# EAGLE design raspdancer21_1.0 (EAGLE 6.4)
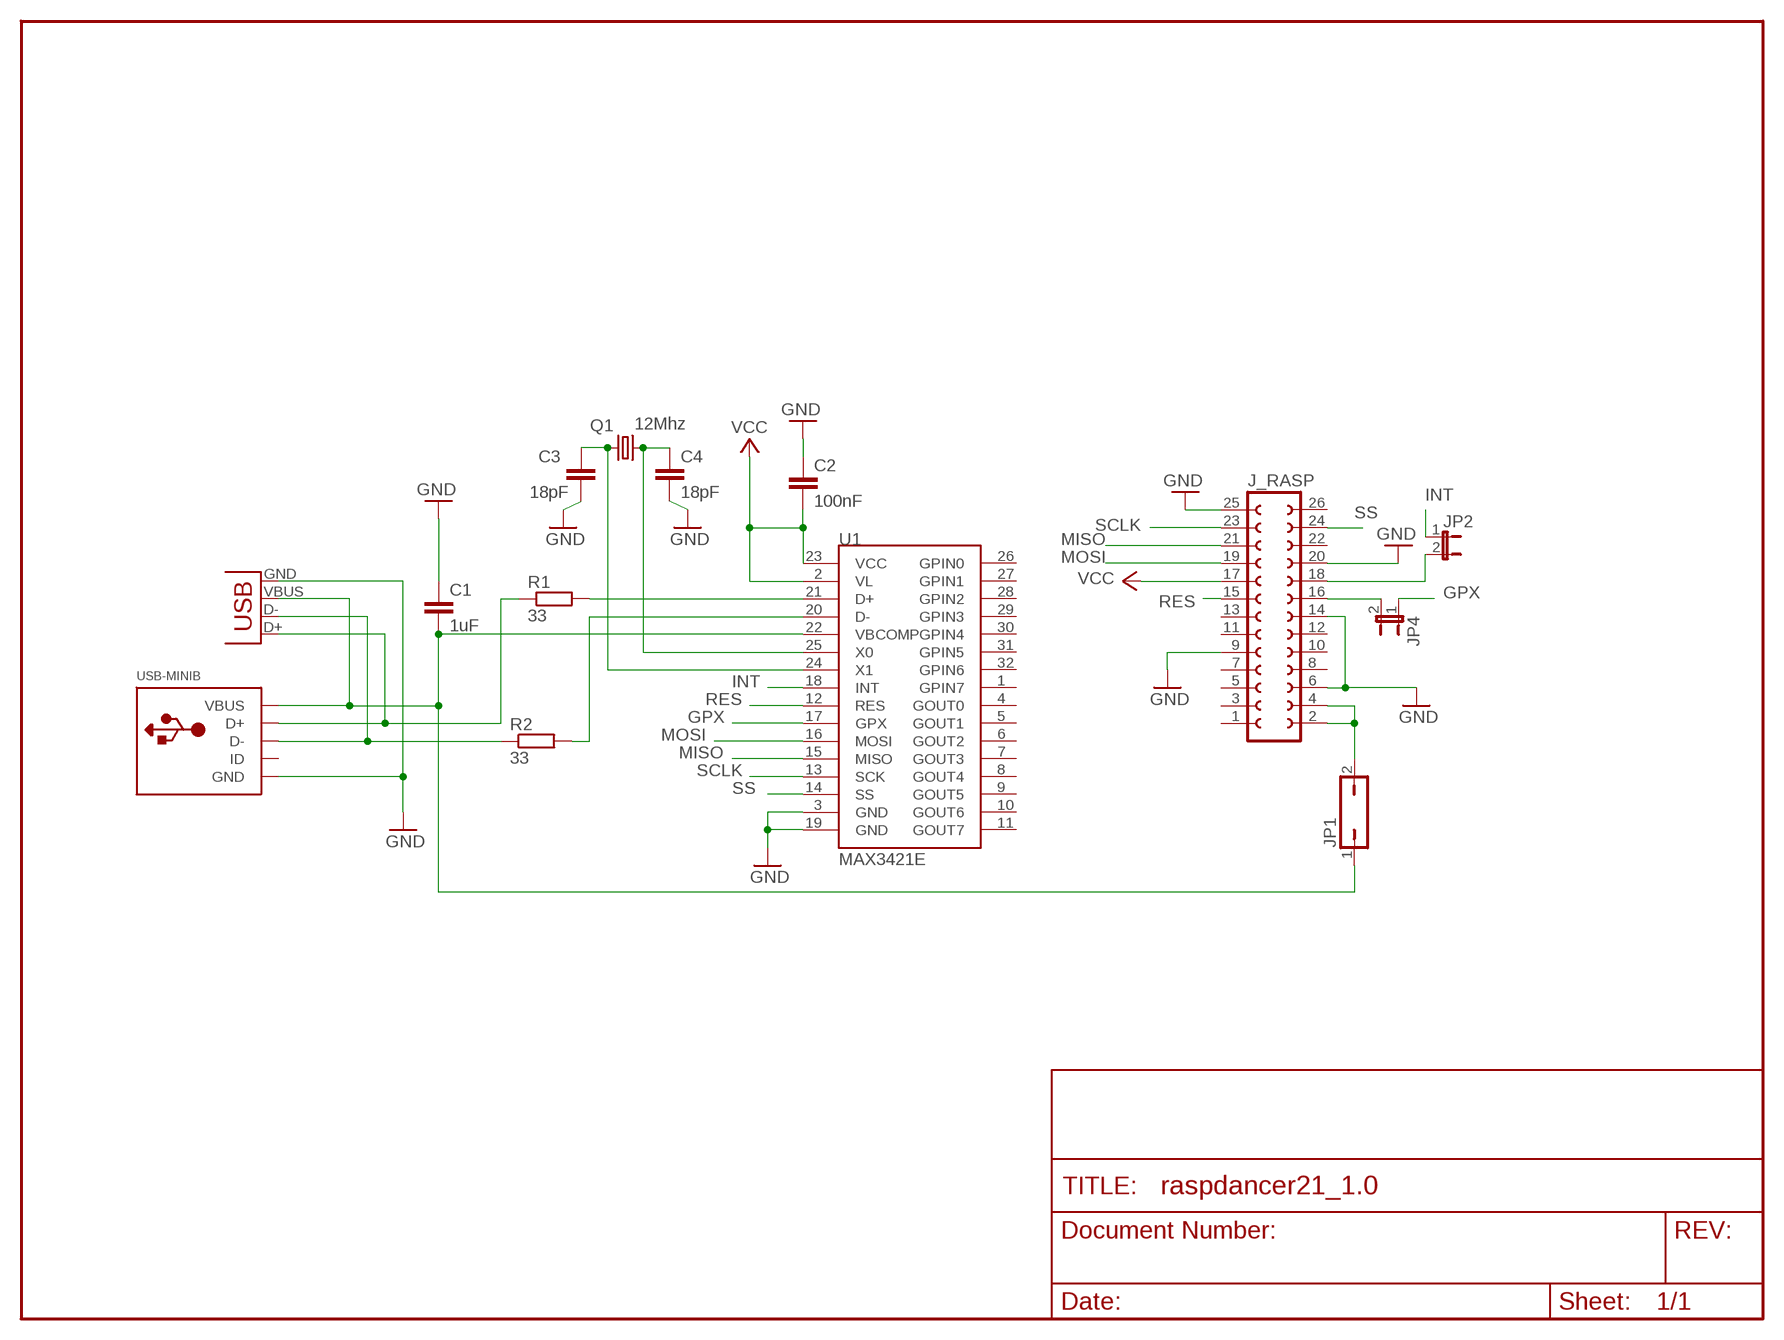
[diagram p0: schematic, sheet 1]

## Parts
C1  1uF  C1206  [C1206]
C2  100nF  C1206  [C1206]
C3  18pF  C1206  [C1206]
C4  18pF  C1206  [C1206]
J_RASP  FE13-2  [FE13-2]
JP1  JP1Q  [JP1]
JP2  JUMPER-2-OLDSMD-NO  [SJ_2S-NO]
JP4  JUMPER-2-OLDSMD-NO  [SJ_2S-NO]
Q1  12Mhz  CRYSTALCTS406  [CTS406]
R1  33  R1206  [R1206]
R2  33  R1206  [R1206]
U1  MAX3421E  MAX3421ESMD  [TQFP32-5MM]
USB-A  USB-A-S  [USB-A-S]
USB-MINIB  USBMINIB  [USB-MINIB]

## Nets
D+: R1.2 U1.21(D+)
D+2: R1.1 USB-A.D+ USB-MINIB.D+
D-: R2.2 U1.20(D-)
D-2: R2.1 USB-A.D- USB-MINIB.D-
GND: C1.1 C2.1 C3.2 C4.2 J_RASP.6 J_RASP.9 J_RASP.14 J_RASP.20 J_RASP.25 U1.3(GND) U1.19(GND) USB-A.GND USB-MINIB.GND
GPX: JP4.1 U1.17(GPX)
GPX2: J_RASP.16 JP4.2
INT: JP2.1 U1.18(INT)
INT2: J_RASP.18 JP2.2
IX: C4.1 Q1.3 U1.25(X0)
MISO: J_RASP.21 U1.15(MISO)
MOSI: J_RASP.19 U1.16(MOSI)
RES: J_RASP.15 U1.12(RES)
SCLK: J_RASP.23 U1.13(SCK)
SS: J_RASP.24 U1.14(SS)
VBUS: C1.2 JP1.1 U1.22(VBCOMP) USB-A.VBUS USB-MINIB.VBUS
VBUS2: J_RASP.2 J_RASP.4 JP1.2
VCC: C2.2 J_RASP.17 U1.2(VL) U1.23(VCC)
XO: C3.1 Q1.1 U1.24(X1)
Unconnected: J_RASP.1 J_RASP.3 J_RASP.5 J_RASP.7 J_RASP.8 J_RASP.10 J_RASP.11 J_RASP.12 J_RASP.13 J_RASP.22 J_RASP.26 U1.1(GPIN7) U1.4(GOUT0) U1.5(GOUT1) U1.6(GOUT2) U1.7(GOUT3) U1.8(GOUT4) U1.9(GOUT5) U1.10(GOUT6) U1.11(GOUT7) U1.26(GPIN0) U1.27(GPIN1) U1.28(GPIN2) U1.29(GPIN3) U1.30(GPIN4) U1.31(GPIN5) U1.32(GPIN6) USB-MINIB.ID

## Library data of the parts
C1-C4 = 00_mylib:C
J_RASP = doegox:FE13-2: FEMALE HEADER; OC_FARNELL: unknown; OC_NEWARK: unknown
JP1 = jumper:JP1Q: JUMPER
JP2 JP4 = SparkFun:JUMPER-2-OLD: Jumper Basic 0.1" spaced jumper. Use with breakaway headers.
Q1 = crystal:CRYSTAL: CRYSTAL; OC_FARNELL: unknown; OC_NEWARK: unknown
R1 R2 = 00_mylib:R: Resistance
U1 = SparkFun-DigitalIC:MAX3421E: USB Peripheral/Host Controller w/ SPI
USB-A = SparkFun-Connectors:USB: USB Connectors USB-B-PTH is fully proven SKU : PRT-00139/CONN-08278 USB-miniB is fully proven SKU : PRT-00587 USB-A-PCB is untested. USB-A-H is throughly reviewed, but untested. Spark Fun Electronics SKU : PRT-00437 USB-B-SMT is throughly reviewed, but untested. Needs silkscreen touching up. USB-A-S has not been used/tested USB-MB-H has not been used/tested USB-MICROB has been used. CONN-09505
USB-MINIB = adafruit:USB: USB Connectors USBMINIB - Surface Mount Female Mini-B USB Connector 4UConnector: 06564 By microbuilder.eu Thru-hole RA Female Mini-B USB Connector 4UConnector: 18732 By ladyada.net

## Board
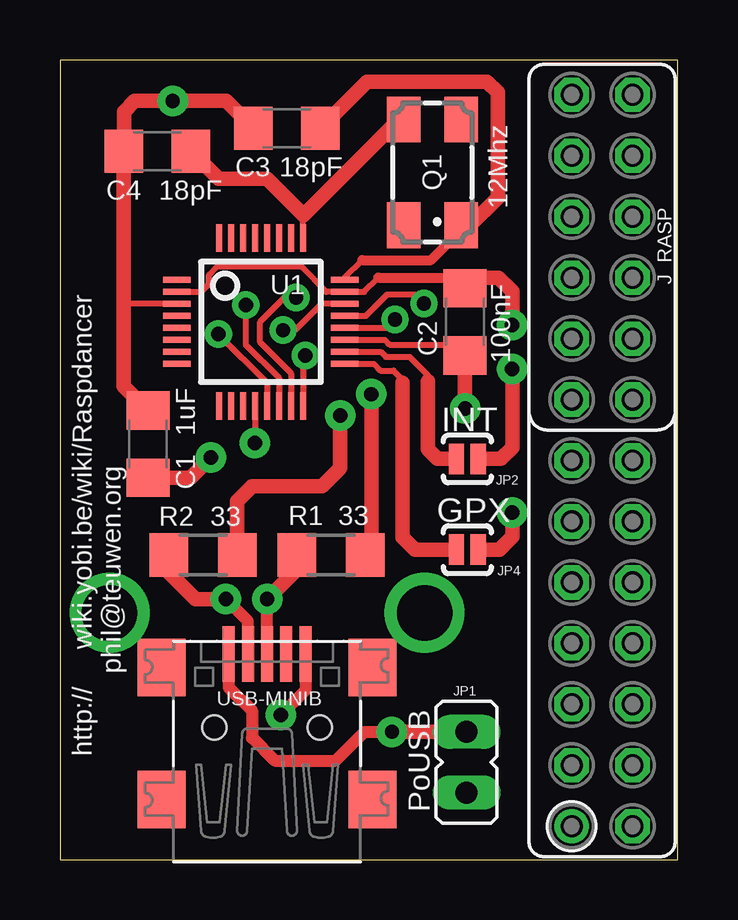
[diagram p1: board, top side]
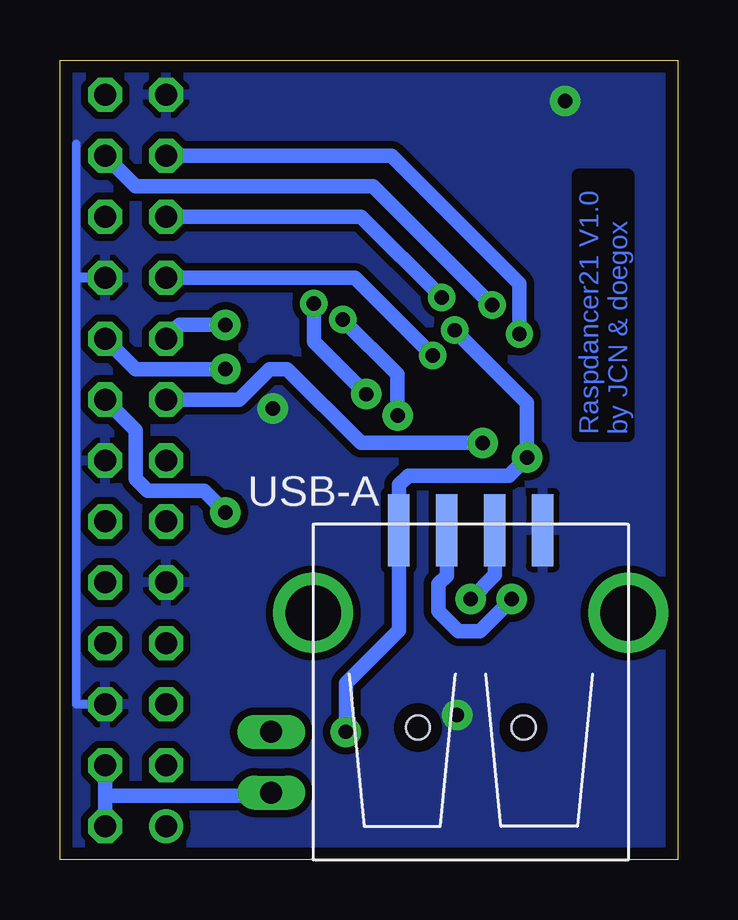
[diagram p2: board, bottom side, seen from below]

Size 25.76 x 33.33 mm. Coordinates in mm from the lower left corner, seen from the top.
Outline: 0,0 25.76,0 25.76,33.33 0,33.33 0,0
Copper layers (1*16): Top 0.035mm / dielectric 1.5mm / Bottom 0.035mm
Design rules "default *": minimum track width 10mil, minimum drill 23mil, track to track 8mil, track to pad 8mil, pad to pad 8mil, via to via 8mil, smd to smd 8mil, copper to edge 20mil, drill to drill 8mil, minimum pad ring 10mil, minimum via ring 8mil, stop-mask expansion 4mil, vias tented up to drill 25mil, thermal gap 10mil

### Footprints (pad centres in the part's own frame; a part is rotated, then mirrored left to right if it is on the bottom)
C1206 = smd 1.6 x 1.8: 1 -1.4,0; 2 1.4,0
FE13-2 = drill 0.914: 1 -15.24,1.27 | drill 0.914 octagon: 2 -15.24,-1.27; 3 -12.7,1.27; 4 -12.7,-1.27; 5 -10.16,1.27; 6 -10.16,-1.27; 7 -7.62,1.27; 8 -7.62,-1.27; 9 -5.08,1.27; 10 -5.08,-1.27; 11 -2.54,1.27; 12 -2.54,-1.27; 13 0,1.27; 14 0,-1.27; 15 2.54,1.27; 16 2.54,-1.27; 17 5.08,1.27; 18 5.08,-1.27; 19 7.62,1.27; 20 7.62,-1.27; 21 10.16,1.27; 22 10.16,-1.27; 23 12.7,1.27; 24 12.7,-1.27; 25 15.24,1.27; 26 15.24,-1.27
JP1 = drill 0.914 long: 1 0,-1.27; 2 0,1.27
SJ_2S-NO = smd 0.635 x 1.27: 1 -0.45,0; 2 0.45,0
CTS406 = smd 1.9 x 1.4: 1 -2.2,-1.2; 2 2.2,-1.2; 3 2.2,1.2; 4 -2.2,1.2
R1206 = smd 1.6 x 1.803: 1 -1.422,0; 2 1.422,0
TQFP32-5MM = smd 1.143 x 0.254: 1 -3.5,1.75; 2 -3.5,1.25; 3 -3.5,0.75; 4 -3.5,0.25; 5 -3.5,-0.25; 6 -3.5,-0.75; 7 -3.5,-1.25; 8 -3.5,-1.75; 17 3.5,-1.75; 18 3.5,-1.25; 19 3.5,-0.75; 20 3.5,-0.25; 21 3.5,0.25; 22 3.5,0.75; 23 3.5,1.25; 24 3.5,1.75 | smd 0.254 x 1.143: 9 -1.75,-3.5; 10 -1.25,-3.5; 11 -0.75,-3.5; 12 -0.25,-3.5; 13 0.25,-3.5; 14 0.75,-3.5; 15 1.25,-3.5; 16 1.75,-3.5; 25 1.75,3.5; 26 1.25,3.5; 27 0.75,3.5; 28 0.25,3.5; 29 -0.25,3.5; 30 -0.75,3.5; 31 -1.25,3.5; 32 -1.75,3.5
USB-A-S = smd 3 x 0.9: D+ 3.45,-1; D- 3.45,1; GND 3.45,-3; VBUS 3.45,3 | drill 2.311: P$5 0,-6.566; P$6 0,6.566
USB-MINIB = smd 0.5 x 2.308: D+ 0,4.064; D- -0.8,4.064; GND 1.6,4.064; ID 0.8,4.064; VBUS -1.6,4.064 | smd 2 x 2.4: GND1 -4.4,-2; GND2 -4.4,3.5; GND3 4.4,3.5; GND4 4.4,-2 | hole 1: -2.2,1; 2.2,1

### Placement (x,y rotation side)
C1  3.67,17.32 270 top
C2  16.89,22.42 90 top
C3  9.46,30.48 180 top
C4  4.06,29.53 180 top
J_RASP  22.61,16.64 90 top
JP1  16.95,4.06 180 top
JP2  16.99,16.7 0 top
JP4  16.99,12.92 0 top
Q1  15.53,28.64 90 top
R1  11.3,12.7 0 top
R2  5.97,12.7 0 top
U1  8.38,22.42 0 top
USB-A  8.64,10.29 90 bottom
USB-MINIB  8.64,4.51 0 top

### Tracks (layer width: path | path; a pad name or v marks a point on that pad's centre or on a via)
D+  (via drill 0.6 pad 1.14, 0.6 pad 1.27)
  Top 0.254: U1.21 12.76,22.67 13.65,23.56 14.8,23.56 v15.18,23.18
  Top 0.406: 13.21,12.7 R1.2
  Top 0.61: v12.99,19.4 12.99,12.96 R1.2
  Bottom 0.61: v12.99,19.4 15.18,21.59 v15.18,23.18
D+2  (via drill 0.6 pad 1.27)
  Top 0.406: 9.87,13.11 R1.1 9.88,12.1
  Top 0.508: USB-MINIB.D+ v8.64,10.86
  Top 0.61: v8.64,10.86 9.88,12.1
  Bottom 0.508: USB-A.D+ 7.64,12.59 7.62,12.57
  Bottom 0.61: v8.64,10.86 7.62,11.87 7.62,12.57
D-  (via drill 0.6 pad 1.14, 0.6 pad 1.27)
  Top 0.254: U1.20 13.62,22.17 v13.97,22.51
  Top 0.61: v11.68,18.51 11.68,16.32 10.92,15.56 8,15.56 7.39,14.95 R2.2
  Bottom 0.61: v11.68,18.51 11.68,20.23 v13.97,22.51
D-2  (via drill 0.6 pad 1.27)
  Top 0.406: USB-MINIB.D- 7.81,8.6 7.84,9.65 | 4.55,11.96 R2.1
  Top 0.508: 7.84,9.65 7.84,9.94 v6.92,10.86 6.89,10.89
  Top 0.61: v6.92,10.86 5.65,10.86 4.55,11.96
  Bottom 0.406: 9.65,13.72 USB-A.D-
  Bottom 0.61: v6.92,10.86 8.26,9.53 9.14,9.53 9.97,10.35 9.97,11.49 9.64,11.83 USB-A.D-
GND  (via drill 0.6 pad 1.27)
  Top 0.254: U1.3 2.68,23.17 | U1.19 13.54,21.67 13.75,21.46 16.51,21.46 16.54,21.5 16.52,21.67 C2.1
  Top 0.406: 2.16,30.23 2.16,29.59 C4.2 | 2.68,23.17 2.66,23.18
  Top 0.508: USB-MINIB.GND 10.24,7.06 v9.21,6.03
  Top 0.61: C3.2 6.92,31.62 v4.7,31.62 3.11,31.62 2.67,31.18 C4.2 | v16.89,18.8 C2.1 | C4.2 2.66,23.18 2.66,19.73 C1.1
  Bottom 0.254: 25.02,24.26 25.08,24.32
  Bottom 0.305: 25.07,29.84 25.08,29.84 25.08,24.32
  Bottom 0.356: 25.07,29.84 25.07,6.48 J_RASP.6
  Bottom 0.406: J_RASP.20 25.02,24.26
  Bottom 0.508: 5.59,13.69 USB-A.GND
  pour Bottom (isolate 0.305): 0,33.27 25.78,33.27 25.78,0 0,0
GPX
  Top 0.254: U1.17 13.09,20.67 13.37,20.38 13.91,20.38 14.29,20 14.29,19.88
  Top 0.61: 14.29,19.88 14.29,13.43 14.8,12.92 JP4.1
GPX2  (via drill 0.6 pad 1.27)
  Top 0.61: v18.86,14.48 18.86,13.46 18.32,12.92 JP4.2
  Bottom 0.61: J_RASP.16 22.61,17.91 22.61,15.88 22.1,15.37 19.75,15.37 v18.86,14.48
INT
  Top 0.254: U1.18 13.38,21.17 13.59,20.95 14.57,20.95 15.34,20.19 15.34,19.94
  Top 0.61: 15.34,19.94 15.34,17.11 15.75,16.7 JP2.1
INT2  (via drill 0.6 pad 1.27)
  Top 0.61: v18.86,20.45 18.86,17.18 18.38,16.7 JP2.2
  Bottom 0.61: v18.86,20.45 22.61,20.45 J_RASP.18
IX
  Top 0.254: U1.25 10.13,26.83 10.16,26.86
  Top 0.406: 14.14,30.84 Q1.3
  Top 0.61: C4.1 6.61,28.38 8.64,28.38 10.16,26.86 14.14,30.84
MISO  (via drill 0.6 pad 1.14)
  Top 0.254: U1.15 9.63,20.28 8.35,21.56 8.35,22.42 9.37,23.43 v9.84,23.43
  Bottom 0.61: J_RASP.21 13.21,26.8 v9.84,23.43
MOSI  (via drill 0.6 pad 1.14)
  Top 0.254: U1.16 10.13,20.93 v10.22,21.02
  Bottom 0.61: v10.22,21.02 13.46,24.26 J_RASP.19
RES  (via drill 0.6 pad 1.27)
  Top 0.254: 8.13,18.9 v8.13,17.37 | 8.13,18.9 | 8.13,18.9 U1.12
  Bottom 0.61: J_RASP.15 18.29,19.18 17.02,20.45 16.29,20.45 13.21,17.37 v8.13,17.37
SCLK  (via drill 0.6 pad 1.14)
  Top 0.254: U1.13 8.63,19.88 v6.6,21.91
  Bottom 0.61: J_RASP.23 11.94,29.34 6.6,24 v6.6,21.91
SS  (via drill 0.6 pad 1.14)
  Top 0.254: U1.14 9.13,20.08 7.75,21.46 v7.75,23.11
  Bottom 0.61: J_RASP.24 22.61,28.07 12.7,28.07 v7.75,23.11
VBUS  (via drill 0.6 pad 1.14, 0.6 pad 1.27)
  Top 0.254: U1.22 10.91,23.17 9.81,22.07 v9.3,22.07
  Top 0.508: USB-MINIB.VBUS 7.04,7.19 8,6.22 8,5.08 8.95,4.13 11.49,4.13 12.7,5.33 v13.84,5.33
  Top 0.61: C1.2 5.44,15.92 v6.29,16.76 | v13.84,5.33 JP1.1
  Bottom 0.406: USB-A.VBUS 11.68,13.79 11.68,14.99 11.62,15.05
  Bottom 0.61: USB-A.VBUS 11.64,9.57 13.84,7.37 v13.84,5.33 | 11.62,15.05 11.62,15.62 11.24,16 7.05,16 v6.29,16.76 6.29,19.05 v9.3,22.07
VBUS2
  Bottom 0.61: J_RASP.4 23.88,2.67 | 23.88,2.67 J_RASP.2 | 23.88,2.67 17.08,2.67 arc-90 JP1.2
VCC  (via drill 0.6 pad 1.27)
  Top 0.254: U1.2 5.89,23.67 6.22,24 6.22,24.38 6.54,24.7 10.06,24.7 11.1,23.67 U1.23 12.68,23.67 13.27,24.26
  Top 0.406: 13.27,24.26 13.28,24.26 16.64,24.26 C2.2 17.33,24.26
  Top 0.61: v18.86,22.29 18.86,23.69 18.29,24.26 17.33,24.26
  Bottom 0.61: v18.86,22.29 20.77,22.29 J_RASP.17
XO
  Top 0.254: U1.24 11.88,24.27 12.61,24.99
  Top 0.406: 12.61,24.99 15.46,24.99 16.73,26.25 Q1.1 17.1,26.44
  Top 0.61: C3.1 12.8,32.42 17.81,32.42 18.26,31.97 18.26,27.59 17.1,26.44

### Text on the board
Bottom: Raspdancer21 V1.0 / by JCN & doegox
tPlace: INT | GPX | http:// wiki.yobi.be/wiki/Raspdancer / phil@teuwen.org | PoUSB